# EasyEDA Pro project MSDR_EzEdaPro.eprj, board PCB6
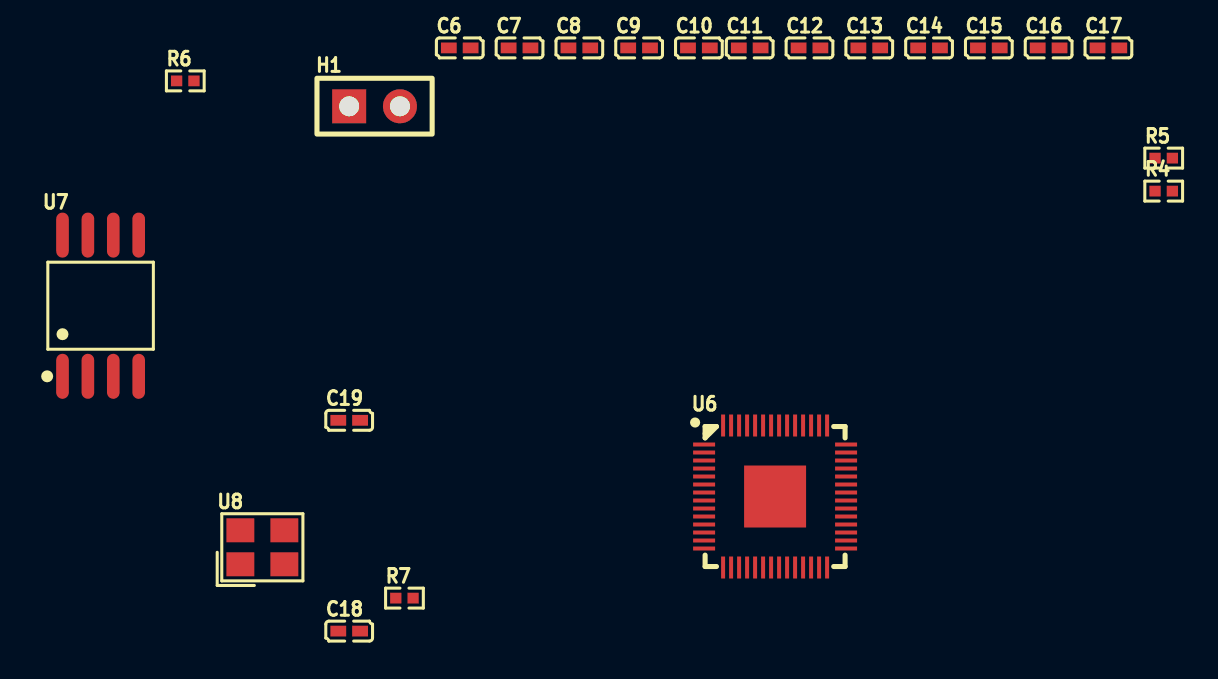
[diagram p6: board, top side]
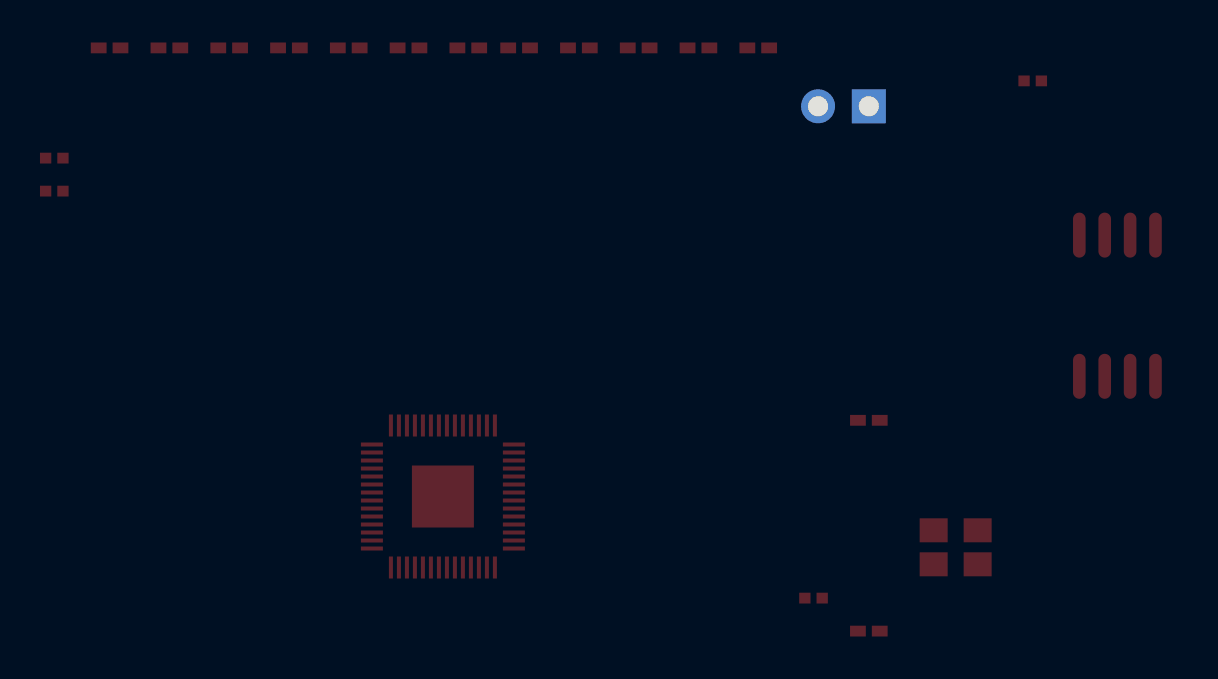
[diagram p7: board, bottom side, seen from below]

No outline. copper layers: Top Layer, Bottom Layer. Coordinates in mm from the lowest, leftmost part position.
Stack: Top Layer 0.035mm / Dielectric1 1.51mm FR4 er 4.5 / Bottom Layer 0.035mm

## Design rules (mm)
template: JLCPCB Capability(Two Layers Board)
spacing copperThickness1oz (default): track to track 0.102, other pairs 0.152 to 0.3
spacing copperThickness2oz: track to track 0.203, other pairs 0.152 to 0.3
track width copperThickness1oz (default): min 0.127, default 0.254, max 2.54
track width copperThickness2oz: min 0.203, default 0.254, max 2.54
differential pair differentialPair (default): width min 0.127, default 0.254, max 2.54; gap min 0.152, default 0.152
via viaSize (default): diameter min 0.5, default 0.61, max 10; hole min 0.3, default 0.305, max 6.3

## Placement (name value [footprint] x y rotation side)
C6  100nF  [C0402]  17.96 29.16 0 top
C7  100nF  [C0402]  20.95 29.16 0 top
C8  1uF  [C0402]  23.94 29.16 0 top
C9  1uF  [C0402]  26.93 29.16 0 top
C10  100nF  [C0402]  29.92 29.16 0 top
C11  100nF  [C0402]  32.46 29.16 0 top
C12  100nF  [C0402]  35.45 29.16 0 top
C13  100nF  [C0402]  38.44 29.16 0 top
C14  100nF  [C0402]  41.43 29.16 0 top
C15  100nF  [C0402]  44.42 29.16 0 top
C16  100nF  [C0402]  47.41 29.16 0 top
C17  100nF  [C0402]  50.4 29.16 0 top
C18  15p  [C0402]  12.43 0 0 top
C19  15p  [C0402]  12.43 10.54 0 top
H1  -  [HDR-TH_2P-P2.54-V-F]  13.7 26.24 0 top
R4  10K  [R0402]  53.16 22 0 top
R5  10K  [R0402]  53.16 23.65 0 top
R6  1k  [R0402]  4.24 27.51 0 top
R7  10K  [R0402]  15.2 1.65 0 top
U6  RP2040  [LQFN-56_L7.0-W7.0-P0.4-EP]  33.73 6.73 0 top
U7  W25Q128JVSIQ  [SOIC-8_L5.3-W5.3-P1.27-LS8.0-BL]  0 16.27 0 top
U8  ABM8-272-T3  [CRYSTAL-SMD_4P-L3.2-W2.5-BL]  8.09 4.19 0 top

## Footprints (pads in the part's own frame, mm; a bottom-side part is the same pattern mirrored in y, then rotated)
C0402
  rect 0.79x0.54 smd: 1(-0.545,0) 2(0.545,0)
CRYSTAL-SMD_4P-L3.2-W2.5-BL
  rect 1.4x1.2 smd: 1(-1.1,-0.85) 2(1.1,-0.85) 3(1.1,0.85) 4(-1.1,0.85)
HDR-TH_2P-P2.54-V-F
  rect 1.7x1.7 hole 1: 1(-1.27,0)
  round 1.7 hole 1: 2(1.27,0)
LQFN-56_L7.0-W7.0-P0.4-EP
  rect 1.1x0.2 smd: 1(-3.55,2.6) 2(-3.55,2.2) 3(-3.55,1.8) 4(-3.55,1.4) 5(-3.55,1) 6(-3.55,0.6) 7(-3.55,0.2) 8(-3.55,-0.2) 9(-3.55,-0.6) 10(-3.55,-1) 11(-3.55,-1.4) 12(-3.55,-1.8) 13(-3.55,-2.2) 14(-3.55,-2.6) 29(3.55,-2.6) 30(3.55,-2.2) 31(3.55,-1.8) 32(3.55,-1.4) 33(3.55,-1) 34(3.55,-0.6) 35(3.55,-0.2) 36(3.55,0.2) 37(3.55,0.6) 38(3.55,1) 39(3.55,1.4) 40(3.55,1.8) 41(3.55,2.2) 42(3.55,2.6)
  rect 0.2x1.1 smd: 15(-2.6,-3.55) 16(-2.2,-3.55) 17(-1.8,-3.55) 18(-1.4,-3.55) 19(-1,-3.55) 20(-0.6,-3.55) 21(-0.2,-3.55) 22(0.2,-3.55) 23(0.6,-3.55) 24(1,-3.55) 25(1.4,-3.55) 26(1.8,-3.55) 27(2.2,-3.55) 28(2.6,-3.55) 43(2.6,3.55) 44(2.2,3.55) 45(1.8,3.55) 46(1.4,3.55) 47(1,3.55) 48(0.6,3.55) 49(0.2,3.55) 50(-0.2,3.55) 51(-0.6,3.55) 52(-1,3.55) 53(-1.4,3.55) 54(-1.8,3.55) 55(-2.2,3.55) 56(-2.6,3.55)
  rect 3.1x3.1 smd: 57(0,0)
R0402
  rect 0.566x0.54 smd: 1(-0.433,0) 2(0.433,0)
SOIC-8_L5.3-W5.3-P1.27-LS8.0-BL
  oval 0.63x2.25 smd: 1(-1.905,-3.53) 2(-0.635,-3.53) 3(0.635,-3.53) 4(1.905,-3.53) 5(1.905,3.53) 6(0.635,3.53) 7(-0.635,3.53) 8(-1.905,3.53)

## Nets
As in the schematic, except:
1.1V: C6.2 C7.2 C8.2 U6.23 U6.45 U6.50
3.3V: C9.2 C10.2 C11.2 C12.2 C13.2 C14.2 C15.2 C16.2 C17.2 R6.1 U6.1 U6.10 U6.22 U6.33 U6.42 U6.43 U6.44 U6.48 U6.49 U6.56 U7.1 U7.8

Pads without a net: R4 1; R5 1; U6 24 25 26 27 28 29 30 31 32 34 35 36 37 38
